# EasyEDA Pro project Nudge.eprj

# Schematic EMGTest1
Board Name: Board1; Create Date: 2026-07-14; Page Name: P1; Project Name: Nudge; Schematic Name: EMGTest1; Update Date: 2026-07-19; Company: EasyEDA.com; Page Size: A4; Version: V1.0
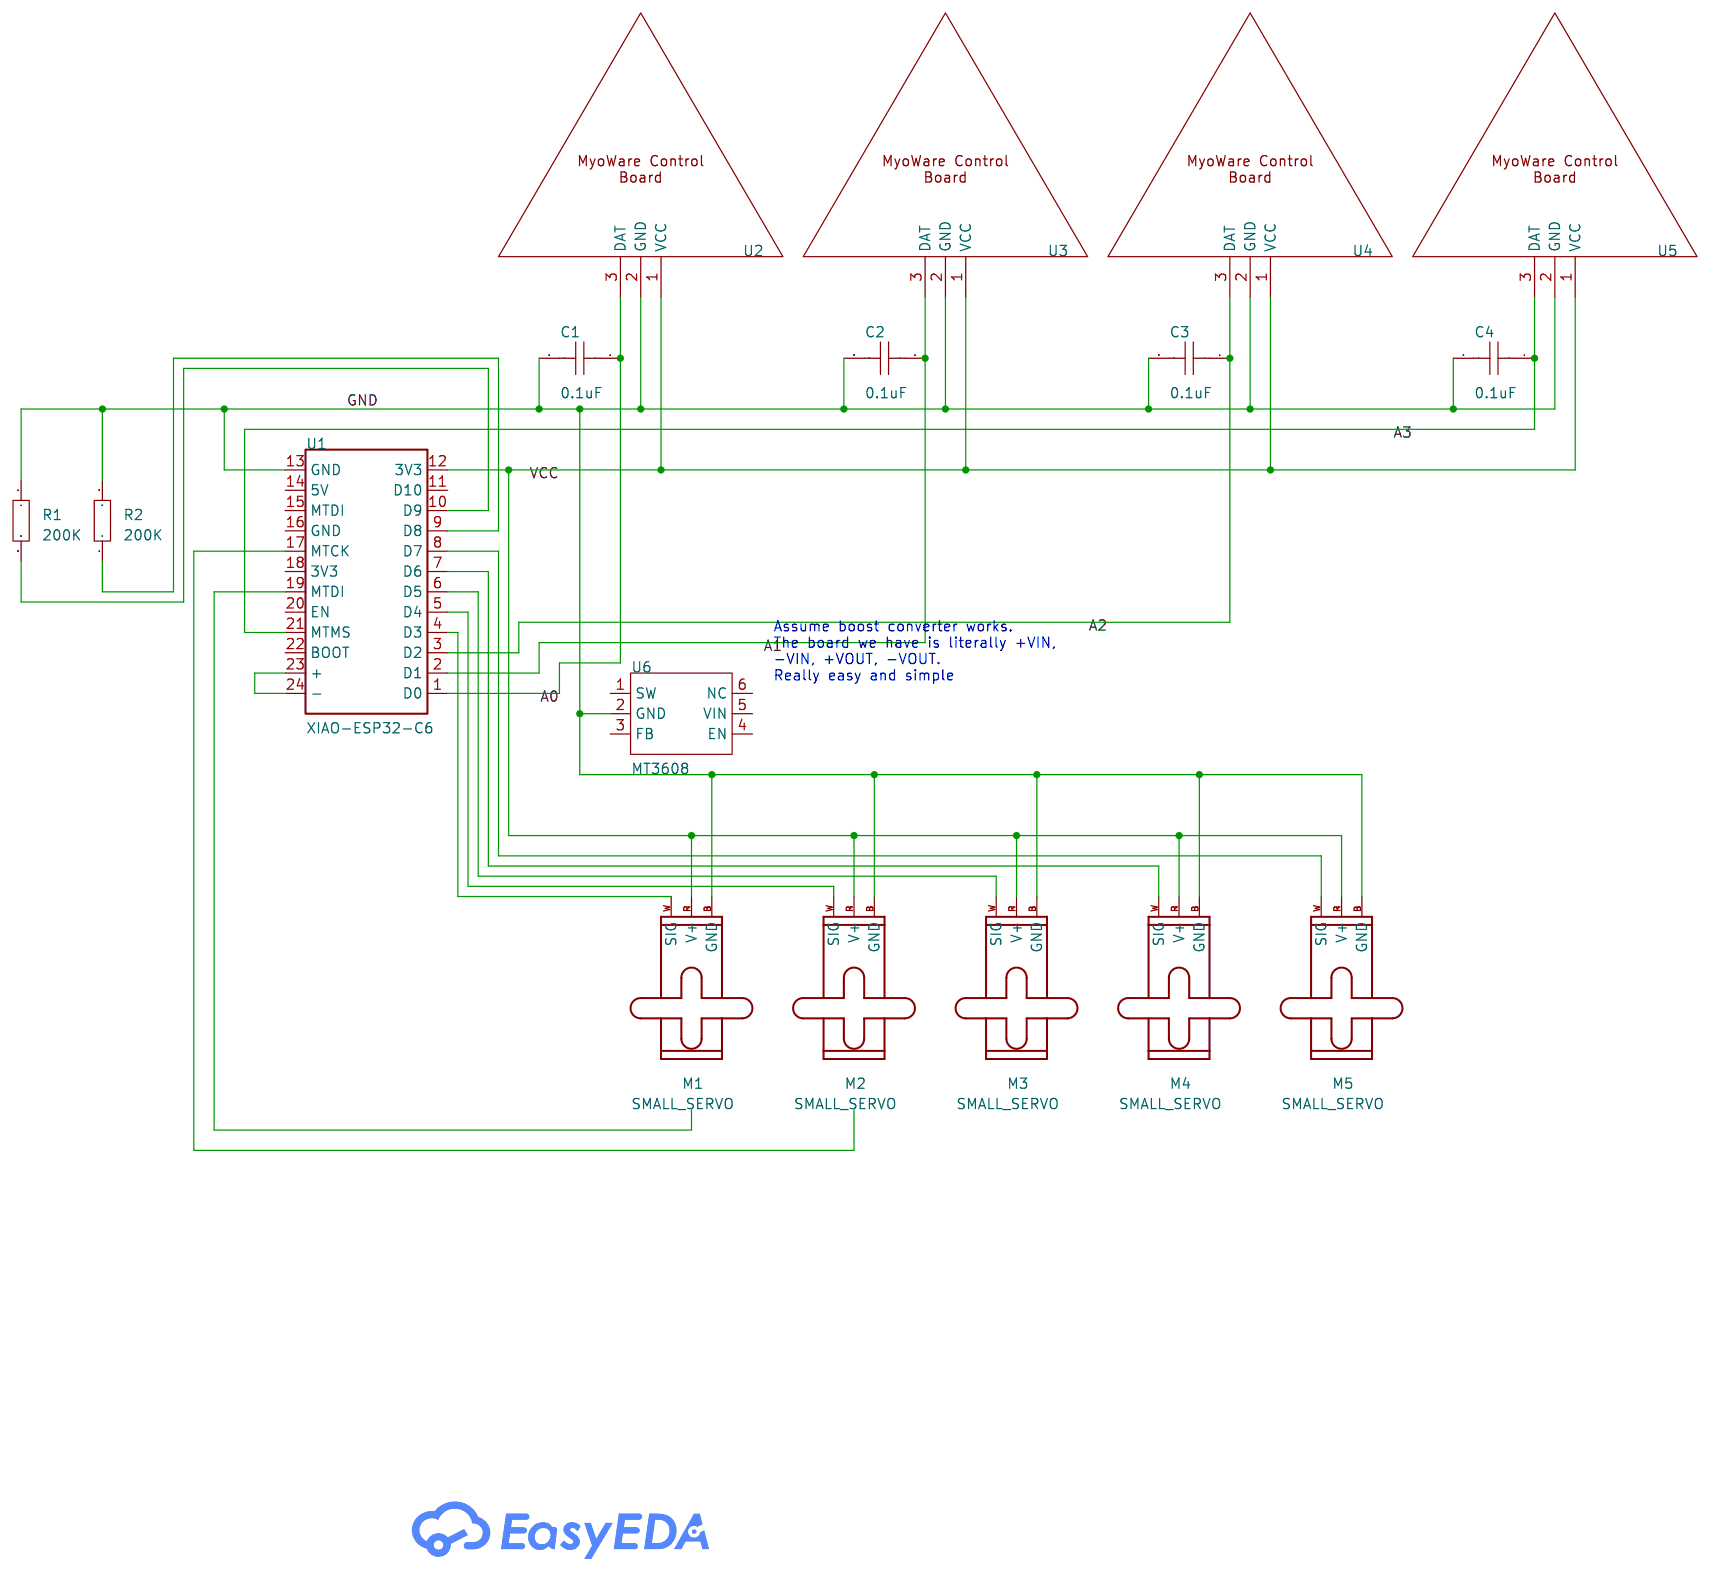
[diagram p0: schematic sheet]

## Parts
C1  0.1uF  [C0603]
C2  0.1uF  [C0603]
C3  0.1uF  [C0603]
C4  0.1uF  [C0603]
M1  SMALL_SERVO
M2  SMALL_SERVO
M3  SMALL_SERVO
M4  SMALL_SERVO
M5  SMALL_SERVO
R1  200K  [R0603]
R2  200K  [R0603]
U1  XIAO-ESP32-C6
U2  -
U3  -
U4  -
U5  -
U6  MT3608  [SOT-23-6_L2.9-W1.6-P0.95-LS2.8-BR]

## Library data of the parts
C1-C4 = CAP_0603: Supplier Footprint: 0603
M1-M5 = SMALL_SERVO
R1 R2 = Res_0603: Supplier Footprint: 0603
U1 = XIAO-ESP32-C6: Supplier: LCSC; Supplier Part: C9900124963; Manufacturer: null; JLCPCB Part Class: Extended Part
U2-U5 = MyoWare Board
U6 = MT3608_C49339555: LCSC Part Name: 新版本 启动电压2.5V 高效1.2MHz电流模式升压转换器; Supplier Part: C49339555; Manufacturer: 西安航天民芯; Supplier Footprint: SOT-23-6; JLCPCB Part Class: Extended Part; Datasheet: https://item.szlcsc.com/datasheet/MT3608/51827794.html; Supplier: LCSC; Function: Boost; Voltage - Supply: 2.5V~24V; Output Voltage: 28V; Frequency - Switching: 1.2MHz; Operating Temperature: -40℃~+85℃; Synchronous Rectifier: No; Number of Outputs: 1; Topology: Boost; Quiescent Current: 70uA; Switch tube (built-in/external): Built-in; Output Type: Adjustable; Features: Light load efficient mode；Overcurrent Protection

## Nets
GND: C1.2 C2.2 C3.2 C4.2 M1.3(GND) M2.3(GND) M3.3(GND) M4.3(GND) M5.3(GND) R1.1 R2.2 U1.13(GND) U2.2(GND) U3.2(GND) U4.2(GND) U5.2(GND) U6.2(GND)
VCC: M1.2(V+) M2.2(V+) M3.2(V+) M4.2(V+) M5.2(V+) U1.12(3V3) U2.1(VCC) U3.1(VCC) U4.1(VCC) U5.1(VCC)
A0: C1.1 U1.1(D0) U2.3(DAT)
A1: C2.1 U1.2(D1) U3.3(DAT)
A2: C3.1 U1.3(D2) U4.3(DAT)
A3: C4.1 U1.21(MTMS) U5.3(DAT)
Net-(M1-1): M1.1(SIG) U1.4(D3)
Net-(M2-1): M2.1(SIG) U1.5(D4)
Net-(M3-1): M3.1(SIG) U1.6(D5)
Net-(M4-1): M4.1(SIG) U1.7(D6)
Net-(M5-1): M5.1(SIG) U1.8(D7)
Net-(R1-2): R1.2 U1.10(D9)
Net-(R2-1): R2.1 U1.9(D8)
Net-(U1-23): U1.23(+) U1.24(-)

Not connected (* = marked no-connect by the designer): U1 11(D10) 14(5V) 15(MTDI) 16(GND) 17(MTCK) 18(3V3) 19(MTDI) 20(EN) 22(BOOT); U6 1(SW) 3(FB) 4(EN) 5(VIN) 6(NC)

## Notes on the sheet
- Assume boost converter works.
  The board we have is literally +VIN,
  -VIN, +VOUT, -VOUT.
  Really easy and simple
